# Altium schematic sheet Charlotte5822_32-Channel-Wireless-Headstage__PCB_AltiumDesigner_FPGA_iCEStick_Schematic1_2__1_P1.schdoc
size 431 x 309 mm; Symbol: sheet-symbol_a4; Device: Sheet-Symbol_A4; Company: 嘉立创EDA; Version: V1.0; Page Size: A4; @Project Name: 7SPI_BX; @Page Count: 1; @Update Date: 2024-09-03; @Create Date: 2024-09-03; @Schematic Name: Schematic1_2; @Page No: 1; @Page Name: P1.Schematic1_2
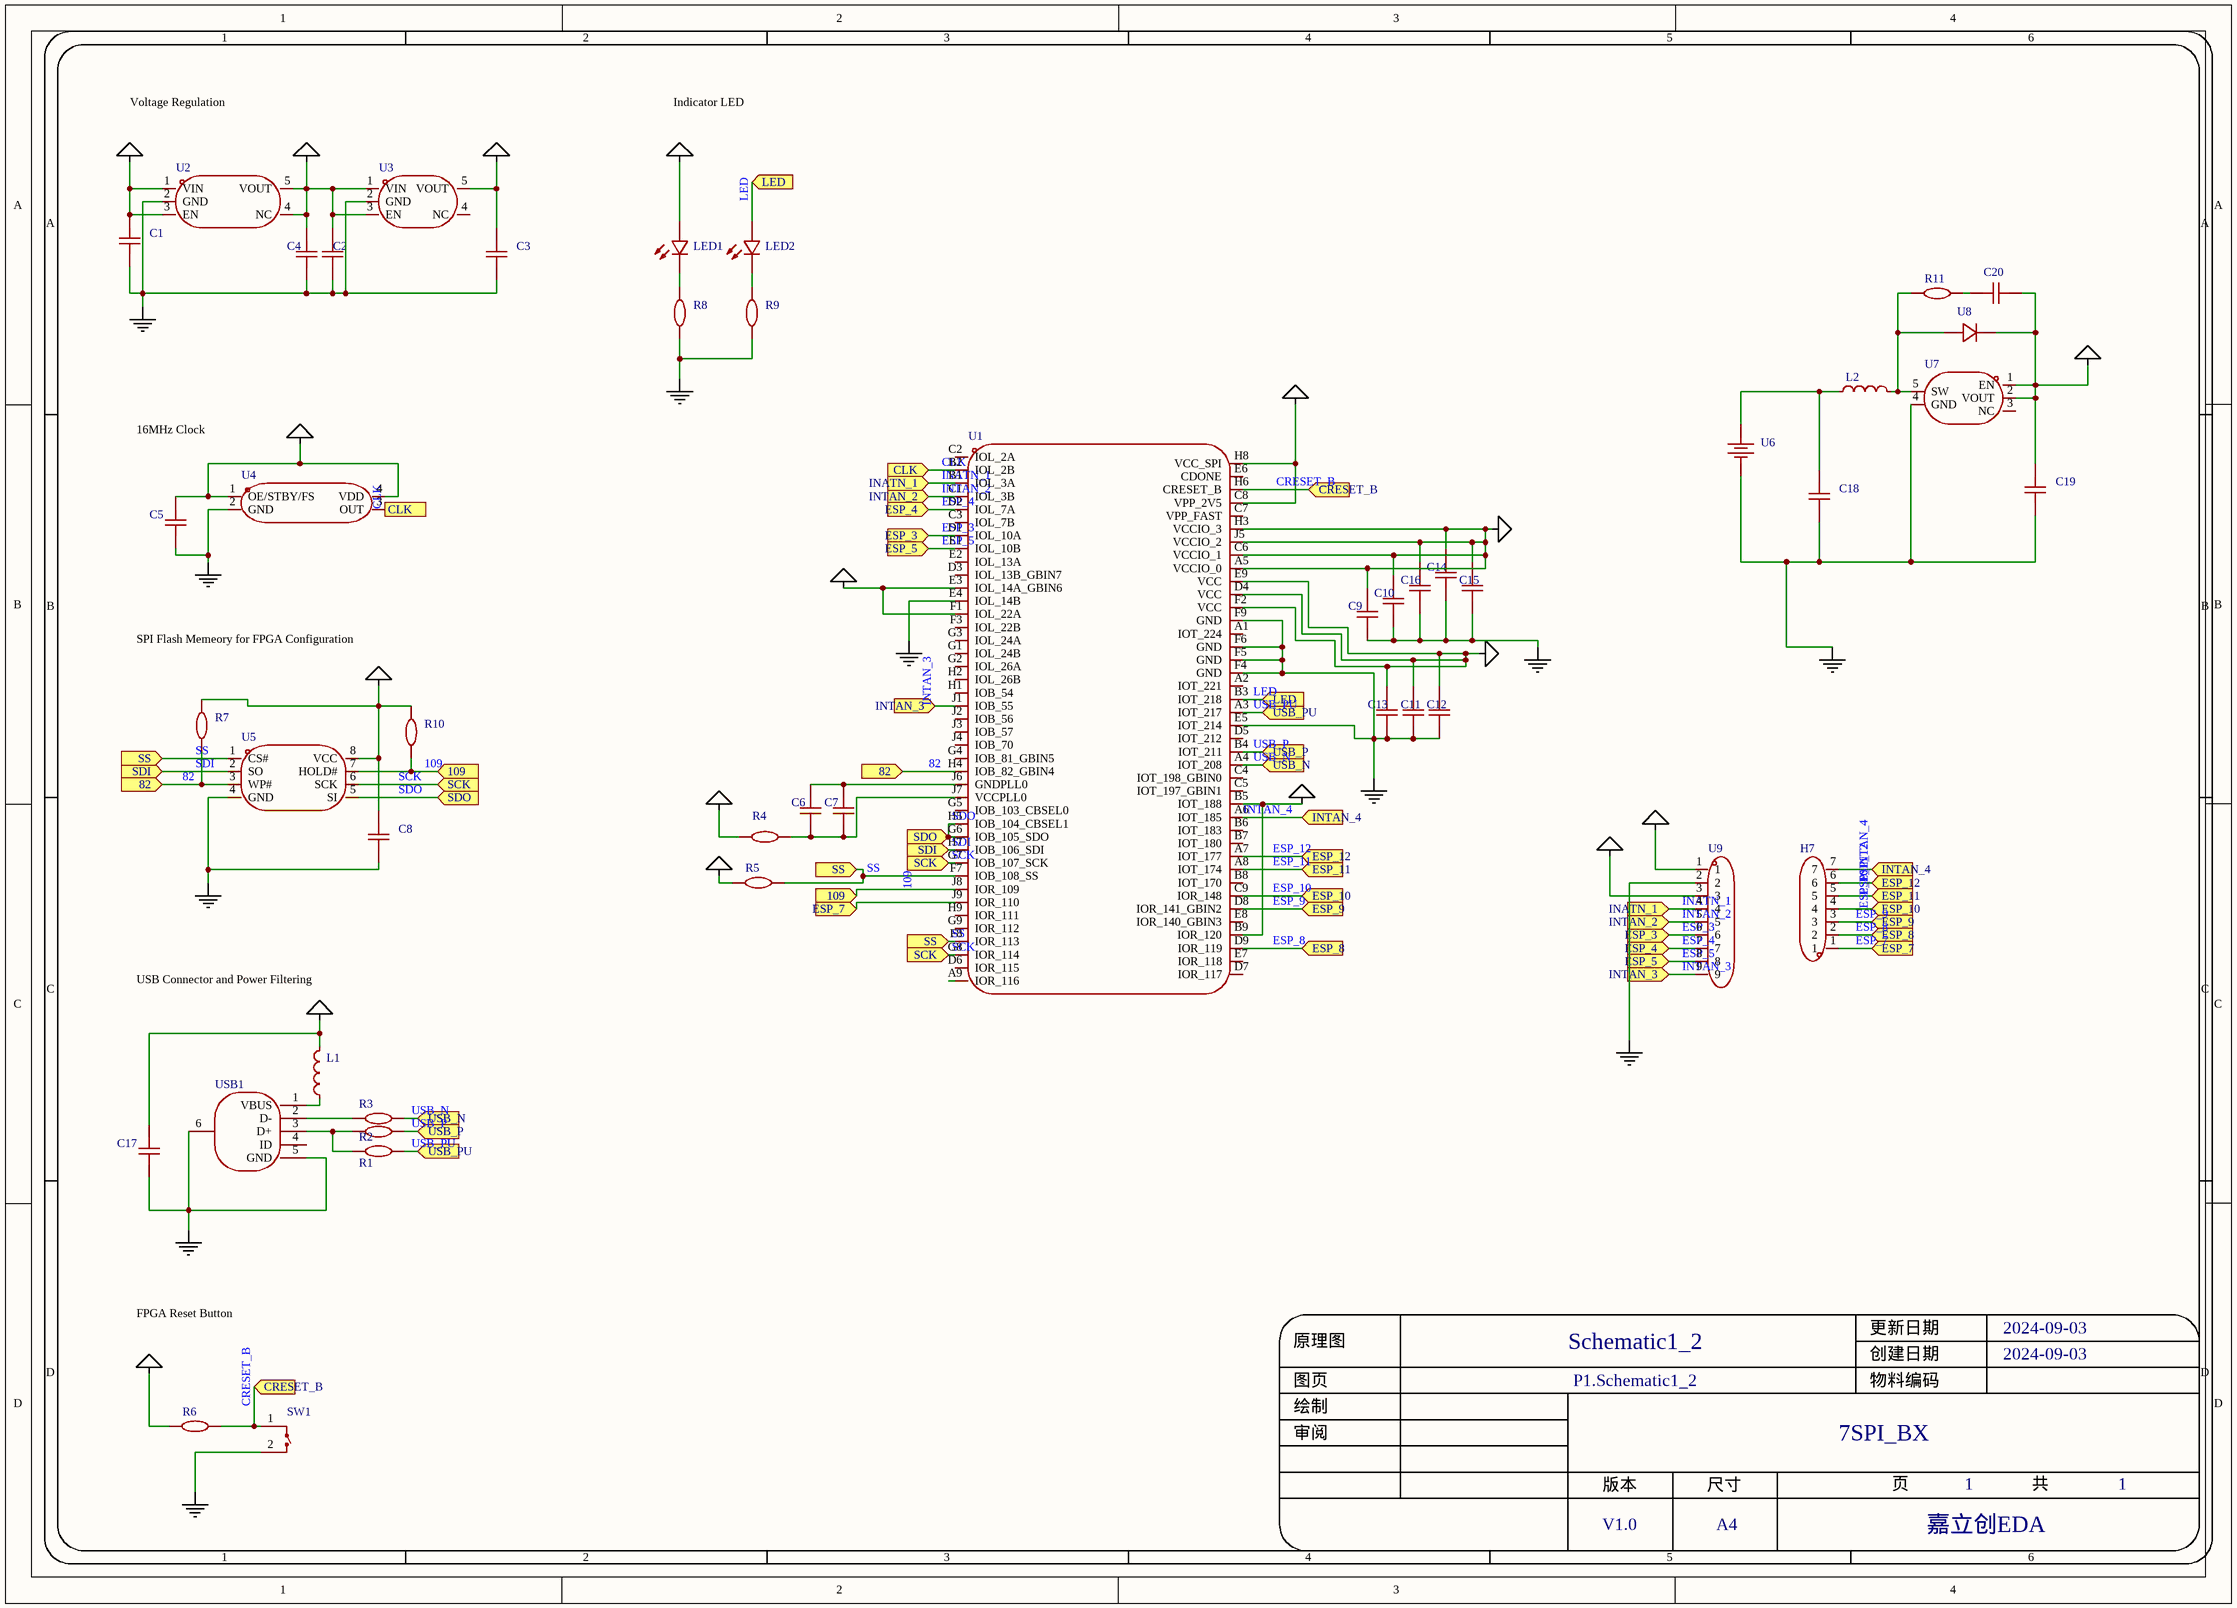
[diagram p0: Charlotte5822_32-Channel-Wireless-Headstage__PCB_AltiumDesigner_FPGA_iCEStick_Schematic1_2__1_P1.schdoc]

## Parts
C1  1uF  [C0201]  (value not drawn)
C2  1uF  [C0201]  (value not drawn)
C3  1uF  [C0201]  (value not drawn)
C4  1uF  [C0201]  (value not drawn)
C5  100nF  [C0201]  (value not drawn)
C6  10uF  [C0402]  (value not drawn)
C7  100nF  [C0201]  (value not drawn)
C8  100nF  [C0201]  (value not drawn)
C9  100nF  [C0201]  (value not drawn)
C10  100nF  [C0201]  (value not drawn)
C11  100nF  [C0201]  (value not drawn)
C12  10nF  [C0201]  (value not drawn)
C13  10nF  [C0201]  (value not drawn)
C14  10nF  [C0201]  (value not drawn)
C15  10nF  [C0201]  (value not drawn)
C16  100nF  [C0201]  (value not drawn)
C17  10uF  [C0402]  (value not drawn)
C18  100nF  [C0402]  (value not drawn)
C19  22uF  [C0402]  (value not drawn)
C20  4.7uF  [C0402]  (value not drawn)
H7  PZ254V-11-07P  [HDR-TH_7P-P2.54-V-M]  (value not drawn)
L1  3.3uH  [L0603]  (value not drawn)
L2  3.3uH  [L0603]  (value not drawn)
LED1  NCD0603R1  [LED0603-RD_RED]  (value not drawn)
LED2  NCD0603R1  [LED0603-RD_RED]  (value not drawn)
R1  1.5kΩ  [R0201]  (value not drawn)
R2  68Ω  [R0201]  (value not drawn)
R3  68Ω  [R0201]  (value not drawn)
R4  100Ω  [R0201]  (value not drawn)
R5  10kΩ  [R0201]  (value not drawn)
R6  4.7kΩ  [R0201]  (value not drawn)
R7  10kΩ  [R0201]  (value not drawn)
R8  270Ω  [R0201]  (value not drawn)
R9  270Ω  [R0201]  (value not drawn)
R10  10kΩ  [R0201]  (value not drawn)
R11  10kΩ  [R0402]  (value not drawn)
SW1  TS-3025-A-A-B  [SW-SMD_L3.0-W2.5-P3.40-LS4.0-L]  (value not drawn)
U1  ICE40LP8K-CM81  [ice40_spec]  (value not drawn)
U2  MIC5504-3.3YM5-TR  [SOT-23-5_L3.0-W1.7-P0.95-LS2.8-TL]  (value not drawn)
U3  MIC5365-1.2YC5-TR  [SC-70-5_L2.1-W1.3-P0.65-LS2.1-BL]  (value not drawn)
U4  DSC6001CI2A-016.0000  [OSC-SMD_4P-L3.2-W2.5-BL_DSC1001CL5]  (value not drawn)
U5  AT25SF081-SSHD-B  [SOP-8_L4.9-W3.9-P1.27-LS6.0-BL]  (value not drawn)
U6  MS621FE-FL11E  [BAT-SMD_FL11E]  (value not drawn)
U7  PW5100-50  [SOT-23-5_L2.9-W1.6-P0.95-LS2.8-BL]  (value not drawn)
U8  CD4148WSP  [D0805-RD]  (value not drawn)
U9  PM254-1-09-Z-8.5  [HDR-TH_9P-P2.54-V-F]  (value not drawn)
USB1  MICRO QTZB5.0  [MICRO-USB-SMD_MICRO-QTZB5.0]  (value not drawn)

## Ports
82 (in), 109 (in), CLK (in), CRESET_B (in), ESP_3 (in), ESP_4 (in), ESP_5 (in), ESP_7 (in), ESP_8 (in), ESP_9 (in), ESP_10 (in), ESP_11 (in), ESP_12 (in), INATN_1 (in), INTAN_2 (in), INTAN_3 (in), INTAN_4 (in), LED (in), SCK (in), SDI (in), SDO (in), SS (in), USB_N (in), USB_P (in), USB_PU (in)

## Nets
+1V2: C3.2 C11.2 C12.2 C13.2 R4.1 U1.D4(VCC) U1.E3(IOL_14A_GBIN6) U1.E9(VCC) U1.F1(IOL_22A) U1.F2(VCC) U3.5(VOUT)
+3V3: C2.2 C4.2 C5.2 C8.2 C9.2 C10.2 C14.2 C15.2 C16.2 LED1.2(A) R5.1 R6.1 R7.2 R10.2 U1.A5(VCCIO_0) U1.B5(IOT_188) U1.B9(IOR_120) U1.C6(VCCIO_1) U1.C8(VPP_2V5) U1.H3(VCCIO_3) U1.H8(VCC_SPI) U1.J5(VCCIO_2) U2.4(NC) U2.5(VOUT) U3.1(VIN) U3.3(EN) U4.1(OE/STBY/FS) U4.4(VDD) U5.8(VCC) U9.3
+5V: C1.2 C17.2 C19.2 C20.2 L1.2 U2.1(VIN) U2.3(EN) U7.1(EN) U7.2(VOUT) U8.1(K) U9.1
GND: C1.1 C2.1 C3.1 C4.1 C5.1 C8.1 C9.1 C10.1 C11.1 C12.1 C13.1 C14.1 C15.1 C16.1 C17.1 C18.1 C19.1 R8.1 R9.1 SW1.2 U1.E4(IOL_14B) U1.E5(IOT_214) U1.F4(GND) U1.F5(GND) U1.F6(GND) U1.F9(GND) U2.2(GND) U3.2(GND) U4.2(GND) U5.4(GND) U6.2(-) U7.4(GND) U9.2 USB1.5(GND) USB1.6(EH)
82: R7.1 U1.H4(IOB_82_GBIN4) U5.3(WP#) ; port 82
109: R10.1 U1.J8(IOR_109) U5.7(HOLD#) ; port 109
CLK: U1.B2(IOL_2B) U4.3(OUT) ; port CLK
CRESET_B: R6.2 SW1.1 U1.H6(CRESET_B) ; port CRESET_B
ESP_3: U1.D1(IOL_10A) U9.6 ; port ESP_3
ESP_4: U1.D2(IOL_7A) U9.7 ; port ESP_4
ESP_5: U1.E1(IOL_10B) U9.8 ; port ESP_5
ESP_7: H7.1 U1.J9(IOR_110) ; port ESP_7
ESP_8: H7.2 U1.D9(IOR_119) ; port ESP_8
ESP_9: H7.3 U1.D8(IOR_141_GBIN2) ; port ESP_9
ESP_10: H7.4 U1.C9(IOR_148) ; port ESP_10
ESP_11: H7.5 U1.A8(IOT_174) ; port ESP_11
ESP_12: H7.6 U1.A7(IOT_177) ; port ESP_12
INATN_1: U1.B1(IOL_3A) U9.4 ; port INATN_1
INTAN_2: U1.C1(IOL_3B) U9.5 ; port INTAN_2
INTAN_3: U1.J1(IOB_55) U9.9 ; port INTAN_3
INTAN_4: H7.7 U1.A6(IOT_185) ; port INTAN_4
LED: LED2.2(A) U1.B3(IOT_218) ; port LED
SCK: U1.G7(IOB_107_SCK) U1.G8(IOR_114) U5.6(SCK) ; port SCK
SDI: U1.H7(IOB_106_SDI) U5.2(SO) ; port SDI
SDO: U1.G6(IOB_105_SDO) U1.H5(IOB_104_CBSEL1) U5.5(SI) ; port SDO
SS: R5.2 U1.F7(IOB_108_SS) U1.F8(IOR_113) U5.1(CS#) ; port SS
USB_N: R3.2 U1.A4(IOT_208) ; port USB_N
USB_P: R2.2 U1.B4(IOT_211) ; port USB_P
USB_PU: R1.2 U1.A3(IOT_217) ; port USB_PU
NetC6_1: C6.1 C7.1 R4.2 U1.J7(VCCPLL0)
NetC6_2: C6.2 C7.2 U1.J6(GNDPLL0)
NetC18_2: C18.2 L2.1 U6.1(+)
NetC20_1: C20.1 R11.2
NetL1_1: L1.1 USB1.1(VBUS)
NetL2_2: L2.2 R11.1 U7.5(SW) U8.2(A)
NetLED1_1: LED1.1(K) R8.2
NetLED2_1: LED2.1(K) R9.2
NetR1_1: R1.1 R2.1 USB1.3(D+)
NetR3_1: R3.1 USB1.2(D-)

Not connected (* = marked no-connect by the designer): U1 A1(IOT_224) A2(IOT_221) A9(IOR_116) B6(IOT_183) B7(IOT_180) B8(IOT_170) C2(IOL_2A) C3(IOL_7B) C4(IOT_198_GBIN0) C5(IOT_197_GBIN1) C7(VPP_FAST) D3(IOL_13B_GBIN7) D5(IOT_212) D6(IOR_115) D7(IOR_117) E2(IOL_13A) E6(CDONE) E7(IOR_118) E8(IOR_140_GBIN3) F3(IOL_22B) G1(IOL_24B) G2(IOL_26A) G3(IOL_24A) G4(IOB_81_GBIN5) G5(IOB_103_CBSEL0) G9(IOR_112) H1(IOB_54) H2(IOL_26B) H9(IOR_111) J2(IOB_56) J3(IOB_57) J4(IOB_70); U3 4(NC); U7 3(NC); USB1 4(ID)

## Notes on the sheet
- Voltage Regulation
- Indicator LED
- 16MHz Clock
- SPI Flash Memeory for FPGA Configuration
- USB Connector and Power Filtering
- FPGA Reset Button
- 1
- 2
- 3
- 4
- 5
- 6
- A
- B
- C
- D
- 原理图
- Schematic1_2
- 创建日期
- 更新日期
- 2024-09-03
- 审阅
- 绘制
- 图页
- P1.Schematic1_2
- 物料编码
- 7SPI_BX
- 版本
- 尺寸
- 页
- 共
- V1.0
- A4
- 嘉立创EDA

## Library data of the parts
C1-C4 = GRM033R61C105ME15D: 容值:1uF;精度:±20%;额定电压:16V;材质(温度系数):X5R;; Manufacturer: muRata(村田); Symbol: CapAcitance; Add into BOM: yes; Tolerance: ±20%; Voltage Rated: 16V; Temperature Coefficient: X5R; Device: GRM033R61C105ME15D; LCSC Part Name: 1uF ±20% 16V; Supplier Part: C335102; Manufacturer Part: GRM033R61C105ME15D; Supplier Footprint: 0201; JLCPCB Part Class: Extended Part; Datasheet: https://atta.szlcsc.com/upload/public/pdf/source/20200305/C490387_23319AE8C154DEB24C505E6C82A8106A.pdf; Supplier: LCSC; Convert to PCB: yes; Value: 1uF
C5 C7-C11 C14 C16 = GRM033R61E104KE14D: 容值:100nF;精度:±10%;额定电压:25V;材质(温度系数):X5R;; Manufacturer: muRata(村田); Symbol: CapAcitance; Add into BOM: yes; Tolerance: ±10%; Voltage Rated: 25V; Temperature Coefficient: X5R; Device: GRM033R61E104KE14D; LCSC Part Name: 100nF ±10% 25V; Supplier Part: C76939; Manufacturer Part: GRM033R61E104KE14D; Supplier Footprint: 0201; JLCPCB Part Class: Extended Part; Datasheet: https://atta.szlcsc.com/upload/public/pdf/source/20180307/C76939_15204091018551407727.pdf; Supplier: LCSC; Convert to PCB: yes
  C5 C7-C11 C16: Value: 100nF
  C14: Value: 10nF
C6 C17 = CL05A106MQ5NUNC: 容值:10uF;精度:±20%;额定电压:6.3V;材质(温度系数):X5R;; Manufacturer: SAMSUNG(三星); Symbol: CapAcitance; Add into BOM: yes; Tolerance: ±20%; Voltage Rated: 6.3V; Temperature Coefficient: X5R; Device: CL05A106MQ5NUNC; LCSC Part Name: 10uF ±20% 6.3V; Supplier Part: C15525; Manufacturer Part: CL05A106MQ5NUNC; Supplier Footprint: 0402; JLCPCB Part Class: Basic Part; Datasheet: https://atta.szlcsc.com/upload/public/pdf/source/20220823/2B02EE04F8F211D38A52DCB16EB6BEBA.pdf; Supplier: LCSC; Convert to PCB: yes; Value: 10uF
C12 C13 C15 = GRM033R71A103KA01D: 容值:10nF;精度:±10%;额定电压:10V;材质(温度系数):X7R;; Manufacturer: muRata(村田); Symbol: CapAcitance; Add into BOM: yes; Tolerance: ±10%; Voltage Rated: 10V; Temperature Coefficient: X7R; Device: GRM033R71A103KA01D; LCSC Part Name: 10nF ±10% 10V; Supplier Part: C76941; Manufacturer Part: GRM033R71A103KA01D; Supplier Footprint: 0201; JLCPCB Part Class: Extended Part; Datasheet: https://atta.szlcsc.com/upload/public/pdf/source/20180307/C76941_15204091038901407729.pdf; Supplier: LCSC; Convert to PCB: yes; Value: 10nF
C18 = CC0402KRX7R7BB104: 容值:100nF;精度:±10%;额定电压:16V;材质(温度系数):X7R;; Manufacturer: YAGEO(国巨); Symbol: CapAcitance; Add into BOM: yes; Tolerance: ±10%; Voltage Rated: 16V; Temperature Coefficient: X7R; Device: CC0402KRX7R7BB104; LCSC Part Name: 100nF ±10% 16V; Supplier Part: C60474; Manufacturer Part: CC0402KRX7R7BB104; Supplier Footprint: 0402; JLCPCB Part Class: Extended Part; Datasheet: https://atta.szlcsc.com/upload/public/pdf/source/20211223/9278FD768280B81DDBEF48FA36411A03.pdf; Supplier: LCSC; Convert to PCB: yes; Value: 100nF
C19 = CL05A226MQ5QUNC: 容值:22uF;精度:±20%;额定电压:6.3V;材质(温度系数):X5R;; Manufacturer: SAMSUNG(三星); Symbol: CapAcitance; Add into BOM: yes; Tolerance: ±20%; Voltage Rated: 6.3V; Temperature Coefficient: X5R; Device: CL05A226MQ5QUNC; LCSC Part Name: 22uF ±20% 6.3V; Supplier Part: C105226; Manufacturer Part: CL05A226MQ5QUNC; Supplier Footprint: 0402; JLCPCB Part Class: Extended Part; Datasheet: https://atta.szlcsc.com/upload/public/pdf/source/20210701/176B1C66C962788B628739B687861597.pdf; Supplier: LCSC; Convert to PCB: yes; Value: 22uF
C20 = CL05A475MP5NRNC: 容值:4.7uF;精度:±20%;额定电压:10V;材质(温度系数):X5R;; Manufacturer: SAMSUNG(三星); Symbol: CapAcitance; Add into BOM: yes; Tolerance: ±20%; Voltage Rated: 10V; Temperature Coefficient: X5R; Device: CL05A475MP5NRNC; LCSC Part Name: 4.7uF ±20% 10V; Supplier Part: C23733; Manufacturer Part: CL05A475MP5NRNC; Supplier Footprint: 0402; JLCPCB Part Class: Basic Part; Datasheet: https://atta.szlcsc.com/upload/public/pdf/source/20160218/1457707763339.pdf; Supplier: LCSC; Convert to PCB: yes; Value: 4.7uF
H7 = PZ254V-11-07P: 插针结构:1x7P;间距:2.54mm;行距:-;圆针/方针:方针;安装类型:直插;排数:单排;总PIN位数:7P;额定电流:-;额定电压:-;配合针长度:6mm;塑高:2.5mm;端接针长度:3mm;触头材质:黄铜;触头镀层:-;工作温度范围:-40℃~+105℃;颜色:黑色;; Manufacturer: XFCN(兴飞); Add into BOM: yes; Pin Structure: 1x7P; Pitch: 2.54mm; Circluar Pins/Square Pins: 方针; Symbol: PZ254V-11-07P; Device: PZ254V-11-07P; LCSC Part Name: 间距:2.54mm 1x7P 直插 方针; Supplier Part: C492406; Manufacturer Part: PZ254V-11-07P; Supplier Footprint: 插件,P=2.54mm; JLCPCB Part Class: 扩展库; Datasheet: https://atta.szlcsc.com/upload/public/pdf/source/20200309/C492406_654C533EE691117E22DD9F76C114C2D9.pdf; Supplier: LCSC; Convert to PCB: yes; Row Spacing: -; Mounting Type: 直插; Number of Rows: 单排; Number of Pins: 7P; Current Rating (Max): -; Voltage Rating (Max): -; Length of Mating Pin: 6mm; Insulation Height: 2.5mm; Length of End Connection Pin: 3mm; Contact Material: 黄铜; Contact Plating: -; Operating Temperature Range: -40℃~+105℃; Color: 黑色
L1 = SCL1608Q3R3KSP: 电感值:3.3uH;精度:±10%;额定电流:15mA;饱和电流(Isat):-;直流电阻(DCR):1.55Ω;; Manufacturer: Sunltech(韩国顺磁); Symbol: SDFL1608S100KTF; Add into BOM: yes; Tolerance: ±10%; Rated Current: 15mA; DC Resistance (DCR): 1.55Ω; Device: SCL1608Q3R3KSP; LCSC Part Name: 3.3uH ±10%; Supplier Part: C411948; Manufacturer Part: SCL1608Q3R3KSP; Supplier Footprint: 0603; JLCPCB Part Class: Extended Part; Datasheet: https://atta.szlcsc.com/upload/public/pdf/source/20200731/C411944_7C8237E998DB3EB3F4322F140BC617BA.pdf; Supplier: LCSC; Convert to PCB: yes; Value: 3.3uH; Saturation Current (Isat): -; Q @ Freq: -; Frequency - Self Resonant: -; Ratings: -
L2 = CMI160808U3R3KT: 电感值:3.3uH;精度:±10%;额定电流:15mA;饱和电流(Isat):-;直流电阻(DCR):1Ω;; Manufacturer: FH(风华); Symbol: SDFL1608S100KTF; Add into BOM: yes; Tolerance: ±10%; Rated Current: 15mA; DC Resistance (DCR): 1Ω; Device: CMI160808U3R3KT; LCSC Part Name: 3.3uH ±10%; Supplier Part: C139209; Manufacturer Part: CMI160808U3R3KT; Supplier Footprint: 0603; JLCPCB Part Class: Extended Part; Datasheet: https://atta.szlcsc.com/upload/public/pdf/source/20230223/55F203729CE6F04E1707F35DF12034EB.pdf; Supplier: LCSC; Convert to PCB: yes; Value: 3.3uH; Saturation Current (Isat): -; Q @ Freq: -; Frequency - Self Resonant: -; Ratings: -
LED1 LED2 = NCD0603R1_C84263: 灯头类型:-;发光颜色:红色;正向电压(VF):1.6V~2.6V;功率:65mW;正向电流:20mA;主波长:615nm~630nm;二极管配置:独立二极管;透镜颜色:无色透明透镜;色温:-;发光强度:80mcd~220mcd;发光角度:130°;载带方式:-;工作温度:-30℃~+85℃;; Manufacturer: 国星光电; Symbol: FC-DA1608HRK-620D; Add into BOM: yes; Emitted Color: 红色; Power Dissipation: 65mW; Forward Current: 20mA; Diode Configuration: 独立二极管; Lens Color: 无色透明透镜; Viewing Angle: 130°; Device: NCD0603R1_C84263; Supplier: LCSC; Manufacturer Part: NCD0603R1; Supplier Part: C84263; JLCPCB Part Class: 扩展库; LCSC Part Name: NCD0603R1; Supplier Footprint: 0603; Datasheet: https://atta.szlcsc.com/upload/public/pdf/source/20200820/C84263_DABC6A75E58F576973B407FDBA283D60.pdf; Convert to PCB: yes; Lamp Holder Type: -; Forward Voltage (VF): 1.6V~2.6V; Dominant Wavelength: 615nm~630nm; Peak Wavelength: -; Color Temperature: -; Luminous Intensity: 80mcd~220mcd; Mounting Sytle: -; Operating Temperature: -30℃~+85℃
R1 = 0201WMF1501TEE: 电阻类型:厚膜电阻;阻值:1.5kΩ;精度:±1%;功率:50mW;最大工作电压:25V;温度系数:±200ppm/℃;; Manufacturer: UNI-ROYAL(厚声); Symbol: 电阻; Add into BOM: yes; Tolerance: ±1%; Power(Watts): 50mW; Overload Voltage (Max): 25V; Device: 0201WMF1501TEE; LCSC Part Name: 1.5kΩ ±1% 50mW 厚膜电阻; Supplier Part: C270361; Manufacturer Part: 0201WMF1501TEE; Supplier Footprint: 0201; JLCPCB Part Class: Extended Part; Datasheet: https://atta.szlcsc.com/upload/public/pdf/source/20200306/C422600_1E6D84923E4A46A82E41ADD87F860B5C.pdf; Supplier: LCSC; Convert to PCB: yes; Type: 厚膜电阻; Value: 1.5kΩ; Temperature Coefficient: ±200ppm/℃; Operating Temperature Range: -55℃~+155℃
R2 R3 = RK73H1HTTC68R0F: 电阻类型:厚膜电阻;阻值:68Ω;精度:±1%;功率:50mW;最大工作电压:-;温度系数:±200ppm/℃;; Manufacturer: KOA; Symbol: 电阻; Add into BOM: yes; Tolerance: ±1%; Power(Watts): 50mW; Device: RK73H1HTTC68R0F; LCSC Part Name: 厚膜电阻 68Ω ±1% 50mW; Supplier Part: C830298; Manufacturer Part: RK73H1HTTC68R0F; Supplier Footprint: 0201; JLCPCB Part Class: Extended Part; Datasheet: https://atta.szlcsc.com/upload/public/pdf/source/20190516/C346145_73DC9C40D36D5A63BE57BD2EFB7F1781.pdf; Supplier: LCSC; Convert to PCB: yes; Type: 厚膜电阻; Value: 68Ω; Overload Voltage (Max): -; Temperature Coefficient: ±200ppm/℃; Operating Temperature Range: -55℃~+155℃
R4 = RC0201FR-07100RL: 电阻类型:厚膜电阻;阻值:100Ω;精度:±1%;功率:50mW;最大工作电压:25V;温度系数:±200ppm/℃;; Manufacturer: YAGEO(国巨); Symbol: 电阻; Add into BOM: yes; Tolerance: ±1%; Power(Watts): 50mW; Overload Voltage (Max): 25V; Device: RC0201FR-07100RL; LCSC Part Name: 厚膜电阻 100Ω ±1% 50mW; Supplier Part: C77623; Manufacturer Part: RC0201FR-07100RL; Supplier Footprint: 0201; JLCPCB Part Class: Extended Part; Datasheet: https://atta.szlcsc.com/upload/public/pdf/source/20181009/C309620_DA5935B6E1D48212CB7A533FE518B3C2.pdf; Supplier: LCSC; Convert to PCB: yes; Type: 厚膜电阻; Value: 100Ω; Temperature Coefficient: ±200ppm/℃; Operating Temperature Range: -55℃~+125℃
R5 R7 R10 = 0201WMF1002TEE: 电阻类型:厚膜电阻;阻值:10kΩ;精度:±1%;功率:50mW;最大工作电压:25V;温度系数:±200ppm/℃;; Manufacturer: UNI-ROYAL(厚声); Symbol: 电阻; Add into BOM: yes; Tolerance: ±1%; Power(Watts): 50mW; Overload Voltage (Max): 25V; Device: 0201WMF1002TEE; LCSC Part Name: 10kΩ ±1% 50mW 厚膜电阻; Supplier Part: C473048; Manufacturer Part: 0201WMF1002TEE; Supplier Footprint: 0201; JLCPCB Part Class: Extended Part; Datasheet: https://atta.szlcsc.com/upload/public/pdf/source/20200306/C422600_1E6D84923E4A46A82E41ADD87F860B5C.pdf; Supplier: LCSC; Convert to PCB: yes; Type: 厚膜电阻; Value: 10kΩ; Temperature Coefficient: ±200ppm/℃; Operating Temperature Range: -55℃~+155℃
R6 = 0201WMF4701TEE: 电阻类型:厚膜电阻;阻值:4.7kΩ;精度:±1%;功率:50mW;最大工作电压:25V;温度系数:±200ppm/℃;; Manufacturer: UNI-ROYAL(厚声); Symbol: 电阻; Add into BOM: yes; Tolerance: ±1%; Power(Watts): 50mW; Overload Voltage (Max): 25V; Device: 0201WMF4701TEE; LCSC Part Name: 4.7kΩ ±1% 50mW 厚膜电阻; Supplier Part: C270346; Manufacturer Part: 0201WMF4701TEE; Supplier Footprint: 0201; JLCPCB Part Class: Extended Part; Datasheet: https://atta.szlcsc.com/upload/public/pdf/source/20200306/C422600_1E6D84923E4A46A82E41ADD87F860B5C.pdf; Supplier: LCSC; Convert to PCB: yes; Type: 厚膜电阻; Value: 4.7kΩ; Temperature Coefficient: ±200ppm/℃; Operating Temperature Range: -55℃~+155℃
R8 R9 = 0201WMF2700TEE: 电阻类型:厚膜电阻;阻值:270Ω;精度:±1%;功率:50mW;最大工作电压:25V;温度系数:±200ppm/℃;; Manufacturer: UNI-ROYAL(厚声); Symbol: 电阻; Add into BOM: yes; Tolerance: ±1%; Power(Watts): 50mW; Overload Voltage (Max): 25V; Device: 0201WMF2700TEE; LCSC Part Name: 270Ω ±1% 50mW 厚膜电阻; Supplier Part: C423625; Manufacturer Part: 0201WMF2700TEE; Supplier Footprint: 0201; JLCPCB Part Class: Extended Part; Datasheet: https://atta.szlcsc.com/upload/public/pdf/source/20200306/C422600_1E6D84923E4A46A82E41ADD87F860B5C.pdf; Supplier: LCSC; Convert to PCB: yes; Type: 厚膜电阻; Value: 270Ω; Temperature Coefficient: ±200ppm/℃; Operating Temperature Range: -55℃~+155℃
R11 = RC0402FR-0710KL: 电阻类型:厚膜电阻;阻值:10kΩ;精度:±1%;功率:62.5mW;最大工作电压:50V;温度系数:±100ppm/℃;; Manufacturer: YAGEO(国巨); Symbol: 电阻; Add into BOM: yes; Tolerance: ±1%; Power(Watts): 62.5mW; Overload Voltage (Max): 50V; Voltage Rated: 16V; Device: RC0402FR-0710KL; LCSC Part Name: 厚膜电阻 10kΩ ±1% 62.5mW; Supplier Part: C60490; Manufacturer Part: RC0402FR-0710KL; Supplier Footprint: 0402; JLCPCB Part Class: Extended Part; Datasheet: https://atta.szlcsc.com/upload/public/pdf/source/20170925/C131467_1506321478108990263.pdf; Supplier: LCSC; Convert to PCB: yes; Type: 厚膜电阻; Value: 10kΩ; Temperature Coefficient: ±100ppm/℃; Operating Temperature Range: -55℃~+155℃
SW1 = TS-3025-A-A-B: 电路结构:单刀单掷;按钮形状:圆形按钮;作用力:100gf;安装方式:立贴;开关长度:2.5mm;开关宽度:3mm;开关高度:1.5mm;带支架:不带;触点电流:50mA;额定电压(DC):12V;绝缘电阻:-;带灯:无;机械寿命:10万次;; Manufacturer: XKB Connectivity(中国星坤); Add into BOM: yes; Circuit: 单刀单掷; Actuator Style: 圆形按钮; Operating Force: 100gf; Switch Length: 2.5mm; Switch Width: 3mm; Switch Height: 1.5mm; Strike Gundam: 不带; Contact Current: 50mA; Voltage Rating (DC): 12V; Actuator/Cap Color: 黑色; With Lamp: 无; Mechanical Life: 10万次; Symbol: TS-3025-A-A-B; Device: TS-3025-A-A-B; LCSC Part Name: 2.5*3*1.5mm 立贴 轻触开关; Supplier Part: C561514; Manufacturer Part: TS-3025-A-A-B; Supplier Footprint: SMD; JLCPCB Part Class: 扩展库; Datasheet: https://atta.szlcsc.com/upload/public/pdf/source/20211011/68AF0FEFC0EC3FBA44EB0E1EAE314393.pdf; Supplier: LCSC; Convert to PCB: yes; Mounting Style: 立贴; Insulation Resistance: -; Operating Temperature: -30℃~+85℃
U1 = ICE40LP8K-CM81: 类型:-;逻辑门数量:-;逻辑单元数:7680;逻辑阵列块数:960;; Manufacturer: LATTICE(莱迪思); Add into BOM: yes; Logic Elements / Cells: 7680; Logic Array Blocks: 960; Embedded Block RAM: 131072bit; Symbol: ICE40LP8K-CM81; Device: ICE40LP8K-CM81; LCSC Part Name: ICE40LP8K-CM81; Supplier Part: C1521979; Manufacturer Part: ICE40LP8K-CM81; Supplier Footprint: UCBGA-81; JLCPCB Part Class: 扩展库; Datasheet: https://atta.szlcsc.com/upload/public/pdf/source/20210603/D458FBBE3DBC8DB6CB0D2EB9F65BABC2.pdf; Supplier: LCSC; Convert to PCB: yes; Type: -; Number of Logic Gates: -; Supply Voltage Range - VCCIO: -; Maximum Delay Time Tpd: -; Operating Temperature Range: -40℃~+100℃
U2 = MIC5504-3.3YM5-TR: 输出类型:固定;最大输入电压:5.5V;输出电压:3.3V;最大输出电流:300mA;电源纹波抑制比(PSRR):60dB@(1kHz);输出极性:正极;; Manufacturer: MICROCHIP(美国微芯); Add into BOM: yes; Output Type: 固定; Maximum Input Voltage: 5.5V; Output Voltage: 3.3V; MAX Output Current: 300mA; Dropout Voltage: 380mV@(300mA); standby current: 55uA; Output Polarity: 正极; Number of Outputs: 1; Symbol: MIC5504-3.3YM5-TR; Device: MIC5504-3.3YM5-TR; LCSC Part Name: 输入5.5V 输出3.3V 300mA; Supplier Part: C88419; Manufacturer Part: MIC5504-3.3YM5-TR; Supplier Footprint: SOT-23-5; JLCPCB Part Class: 扩展库; Datasheet: https://atta.szlcsc.com/upload/public/pdf/source/20180329/C95749_2D03E2CDCEE40DDAAF1BC13608301412.pdf; Supplier: LCSC; Convert to PCB: yes; Power Supply Rejection Ratio (PSRR): 60dB@(1kHz); Operating Temperature: -40℃~+125℃
U3 = MIC5365-1.2YC5-TR: 输出类型:固定;最大输入电压:5.5V;输出电压:1.2V;最大输出电流:150mA;电源纹波抑制比(PSRR):80dB;输出极性:正极;; Manufacturer: MICROCHIP(美国微芯); Add into BOM: yes; Output Type: 固定; Maximum Input Voltage: 5.5V; Output Voltage: 1.2V; MAX Output Current: 150mA; Power Supply Rejection Ratio (PSRR): 80dB; Dropout Voltage: 380mV@(150mA); standby current: 39uA; Output Polarity: 正极; Number of Outputs: 1; Symbol: MIC5365-1.2YC5-TR; Device: MIC5365-1.2YC5-TR; LCSC Part Name: 输入5.5V 输出1.2V~1.2V 150mA; Supplier Part: C461594; Manufacturer Part: MIC5365-1.2YC5-TR; Supplier Footprint: SC-70-5; JLCPCB Part Class: 扩展库; Datasheet: https://atta.szlcsc.com/upload/public/pdf/source/20180719/C220617_B2F1B2277663F446E52D506B52998A94.pdf; Supplier: LCSC; Convert to PCB: yes; Operating Temperature: -40℃~+125℃
U4 = DSC6001CI2A-016.0000: Manufacturer: MICROCHIP(美国微芯); Add into BOM: yes; Symbol: DSC6001CI2A-016.0000; Device: DSC6001CI2A-016.0000; LCSC Part Name: DSC6001CI2A-016.0000; Supplier Part: C1670224; Manufacturer Part: DSC6001CI2A-016.0000; Supplier Footprint: SMD3225-4P; JLCPCB Part Class: 扩展库; Datasheet: https://atta.szlcsc.com/upload/public/pdf/source/20220204/C2650861_191B97C70369EA2D8C3836A09455016A.pdf; Supplier: LCSC; Convert to PCB: yes
U5 = AT25SF081-SSHD-B: Manufacturer: Dialog/Adesto; Add into BOM: yes; Symbol: AT25SF081-SSHD-B; Device: AT25SF081-SSHD-B; LCSC Part Name: AT25SF081-SSHD-B; Supplier Part: C169368; Manufacturer Part: AT25SF081-SSHD-B; Supplier Footprint: SOIC-8; JLCPCB Part Class: 扩展库; Datasheet: https://atta.szlcsc.com/upload/public/pdf/source/20180524/C161756_2782323D24EA5EFF9E1EF558BD81513A.pdf; Supplier: LCSC; Convert to PCB: yes
U6 = MS621FE-FL11E: FL11E 3.3V可充电纽扣电池 5.5mAH; Manufacturer: Seiko(精工); Add into BOM: yes; voltage: 3 V; chemical composition: 锂离子; characteristic: 可充电; Packaging quantity: 1; Battery capacity: -；-；-; Symbol: MS621FE-FL11E; Device: MS621FE-FL11E; LCSC Part Name: Seiko/精工，可充电纽扣电池，3V，MS621FE-FL11E，1个; Supplier Part: C80909; Manufacturer Part: MS621FE-FL11E; Supplier Footprint: -; JLCPCB Part Class: 扩展库; Datasheet: https://atta.szlcsc.com/upload/public/pdf/source/20230719/88F2811CC6B30DD05F1C5A5953BF9E77.pdf; Supplier: LCSC; Convert to PCB: yes; capacity: 5.5mAh; temperature range: -20-60°C; size: -; type: 纽扣; Executive standards: -; purpose: -
U7 = PW5100-50: Add into BOM: yes; Symbol: PW5100-50; Device: PW5100-50; LCSC Part Name: PW5100-50; Supplier Part: C9900030923; Manufacturer Part: PW5100-50; Supplier Footprint: SOT23-5L; JLCPCB Part Class: 扩展库; Supplier: LCSC; Convert to PCB: yes
U8 = CD4148WSP: 二极管配置:-;正向压降(Vf):1.25V@100mA;直流反向耐压(Vr):75V;平均整流电流(Io):150mA;功率:400mW;反向恢复时间(trr):4ns;; Manufacturer: LIZ(丽智电子); Symbol: 1N4007_C9900004759; Add into BOM: yes; Reverse Voltage (Vr): 75V; Average Rectified Current (Io): 150mA; Power Dissipation: 400mW; Reverse Leakage Current: 5uA@75V; Reverse Recovery Time (trr): 4ns; Device: CD4148WSP; LCSC Part Name: 电压:75V 电流:150mA; Supplier Part: C109001; Manufacturer Part: CD4148WSP; Supplier Footprint: 0805; JLCPCB Part Class: Extended Part; Datasheet: https://atta.szlcsc.com/upload/public/pdf/source/20170510/1494399695091.pdf; Supplier: LCSC; Convert to PCB: yes; Diode Configuration: -; Forward Voltage (Vf@If): 1.25V@100mA; Operating Temperature: -
U9 = PM254-1-09-Z-8.5: 插孔结构:1x9P;间距:2.54mm;行距:-;圆孔/方孔:方孔;安装类型:直插;排数:单排;总孔位数:9P;额定电流:3A;额定电压:-;插孔方向:顶部;塑高:8.5mm;触头材质:铜合金;工作温度范围:-40℃~+105℃;焊接温度(最大值):260℃@5S;; Manufacturer: HCTL(华灿天禄); Add into BOM: yes; Holes Structure: 1x9P; Pitch: 2.54mm; Circular Hole / Square Hole: 方孔; Number of Holes: 9P; Current Rating (Max): 3A; Holes Direction: 顶部; Symbol: PM254-1-09-Z-8.5; Device: PM254-1-09-Z-8.5; LCSC Part Name: 1x9P 间距:2.54mm 直插; Supplier Part: C2897372; Manufacturer Part: PM254-1-09-Z-8.5; Supplier Footprint: 插件,P=2.54mm; JLCPCB Part Class: 扩展库; Datasheet: https://atta.szlcsc.com/upload/public/pdf/source/20230609/534BE42964C679BDE98E061007C4ABD6.pdf; Supplier: LCSC; Convert to PCB: yes; Row Spacing: -; Mounting Type: 直插; Number of Rows: 单排; Voltage Rating (Max): -; Insulation Height: 8.5mm; Contact Material: 铜合金; Operating Temperature Range: -40℃~+105℃; Soldering Temperature(Max): 260℃@5S
USB1 = MICRO QTZB5.0: 连接器类型:Micro-B;标准:USB 2.0;公母:母;端口数量:1;触点数量:5P;安装方式:卧贴;额定电流 - 电源:1A;工作温度范围:-30℃~+80℃;; Manufacturer: SHOU HAN(首韩); Add into BOM: yes; Gender: 母; Number of Ports: 1; Number of Contacts: 5P; Current Rating - Power (Max): 1A; Symbol: MICRO QTZB5.0; Device: MICRO QTZB5.0; LCSC Part Name: Micro-B 母 卧贴; Supplier Part: C2681556; Manufacturer Part: MICRO QTZB5.0; Supplier Footprint: SMD; JLCPCB Part Class: 扩展库; Datasheet: https://atta.szlcsc.com/upload/public/pdf/source/20210107/C2681556_CFA58CC35A80C3AC7F409A47931A5E57.pdf; Supplier: LCSC; Convert to PCB: yes; Connector Type: Micro-B; Standard: USB 2.0; Mounting Style: 卧贴; Operating Temperature Range: -30℃~+80℃